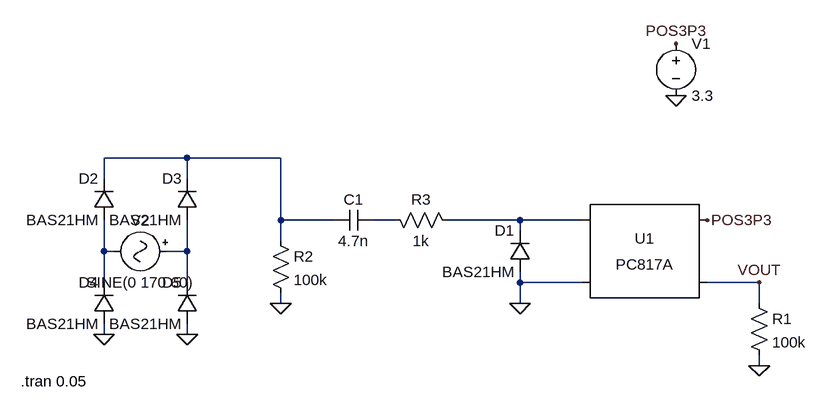
[diagram p0: schematic ZCD.asc]
ZCD.asc, the LTspice schematic file:
Version 4
SHEET 1 880 680
WIRE -400 0 -528 0
WIRE -256 0 -400 0
WIRE -528 32 -528 0
WIRE -400 32 -400 0
WIRE -256 96 -256 0
WIRE -176 96 -256 96
WIRE -80 96 -112 96
WIRE 112 96 0 96
WIRE 208 96 112 96
WIRE 112 112 112 96
WIRE -256 128 -256 96
WIRE -528 144 -528 96
WIRE -512 144 -528 144
WIRE -400 144 -400 96
WIRE -400 144 -432 144
WIRE -528 192 -528 144
WIRE -400 192 -400 144
WIRE 112 192 112 176
WIRE 208 192 112 192
WIRE 480 192 400 192
WIRE -256 224 -256 208
WIRE 112 224 112 192
WIRE 480 224 480 192
WIRE -528 272 -528 256
WIRE -400 272 -400 256
WIRE 480 320 480 304
FLAG 480 320 0
FLAG 352 -96 0
FLAG 352 -176 POS3P3
FLAG 400 96 POS3P3
FLAG 480 192 VOUT
FLAG -400 272 0
FLAG -528 272 0
FLAG -256 224 0
FLAG 112 224 0
SYMBOL Optos\\PC817A 304 144 R0
SYMATTR InstName U1
SYMBOL res 464 208 R0
SYMATTR InstName R1
SYMATTR Value 100k
SYMBOL voltage 352 -192 R0
SYMATTR InstName V1
SYMATTR Value 3.3
SYMBOL diode 128 176 R180
WINDOW 0 24 64 Left 2
WINDOW 3 24 0 Left 2
SYMATTR InstName D1
SYMATTR Value BAS21HM
SYMBOL cap -112 80 R90
WINDOW 0 0 32 VBottom 2
WINDOW 3 32 32 VTop 2
SYMATTR InstName C1
SYMATTR Value 4.7n
SYMBOL res -272 112 R0
SYMATTR InstName R2
SYMATTR Value 100k
SYMBOL Misc\\signal -416 144 R90
WINDOW 0 -32 56 VBottom 2
WINDOW 3 32 56 VTop 2
WINDOW 123 0 0 Left 2
WINDOW 39 0 0 Left 2
SYMATTR InstName V2
SYMATTR Value SINE(0 170 60)
SYMBOL diode -512 96 R180
WINDOW 0 24 64 Left 2
WINDOW 3 24 0 Left 2
SYMATTR InstName D2
SYMATTR Value BAS21HM
SYMBOL diode -384 96 R180
WINDOW 0 24 64 Left 2
WINDOW 3 24 0 Left 2
SYMATTR InstName D3
SYMATTR Value BAS21HM
SYMBOL diode -512 256 R180
WINDOW 0 24 64 Left 2
WINDOW 3 24 0 Left 2
SYMATTR InstName D4
SYMATTR Value BAS21HM
SYMBOL diode -384 256 R180
WINDOW 0 24 64 Left 2
WINDOW 3 24 0 Left 2
SYMATTR InstName D5
SYMATTR Value BAS21HM
SYMBOL res -96 80 M90
WINDOW 0 0 56 VBottom 2
WINDOW 3 32 56 VTop 2
SYMATTR InstName R3
SYMATTR Value 1k
TEXT -656 344 Left 2 !.tran 0.05

The netlist it stands for:
* ZCD.asc
XU1 N003 0 POS3P3 VOUT PC817 Igain=1m
R1 VOUT 0 100k
V1 POS3P3 0 3.3
D1 0 N003 BAS21HM
C1 N002 N001 4.7n
R2 N001 0 100k
V2 N005 N004 SINE(0 170 60)
D2 N004 N001 BAS21HM
D3 N005 N001 BAS21HM
D4 0 N004 BAS21HM
D5 0 N005 BAS21HM
R3 N002 N003 1k
.model D D
.lib standard.dio
.tran 0.05
.lib PC817.sub
.backanno
.end